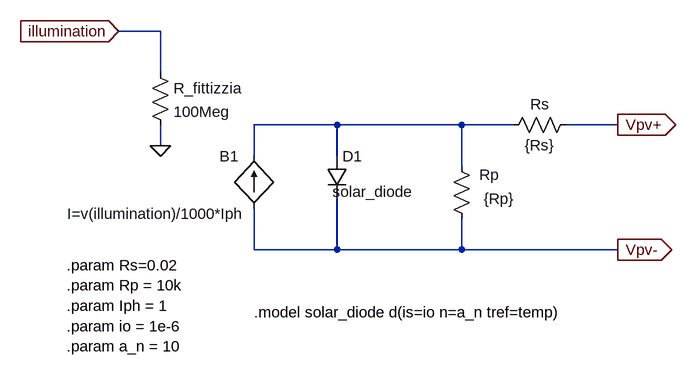
[diagram p0: schematic CellaFotovoltaica.asc]
CellaFotovoltaica.asc, the LTspice schematic file:
Version 4
SHEET 1 880 680
WIRE -80 -64 -144 -64
WIRE -80 0 -80 -64
WIRE 192 80 64 80
WIRE 384 80 192 80
WIRE 464 80 384 80
WIRE 624 80 544 80
WIRE -80 112 -80 80
WIRE 64 128 64 80
WIRE 192 128 192 80
WIRE 384 144 384 80
WIRE 64 272 64 208
WIRE 192 272 192 192
WIRE 192 272 64 272
WIRE 384 272 384 224
WIRE 384 272 192 272
WIRE 624 272 384 272
FLAG -80 112 0
FLAG 624 80 Vpv+
IOPIN 624 80 Out
FLAG 624 272 Vpv-
IOPIN 624 272 Out
FLAG -144 -64 illumination
IOPIN -144 -64 In
SYMBOL bi 64 208 R180
WINDOW 0 24 80 Left 2
WINDOW 3 14 -9 Left 2
SYMATTR InstName B1
SYMATTR Value I=v(illumination)/1000*Iph
SYMBOL diode 176 128 R0
WINDOW 3 9 55 Left 2
SYMATTR Value solar_diode
SYMATTR InstName D1
SYMBOL res 560 64 R90
WINDOW 0 0 56 VBottom 2
WINDOW 3 32 56 VTop 2
SYMATTR InstName Rs
SYMATTR Value {Rs}
SYMBOL res 400 240 R180
WINDOW 0 -42 83 Left 2
WINDOW 3 -65 46 Left 2
SYMATTR InstName Rp
SYMATTR Value {Rp}
SYMBOL res -96 -16 R0
SYMATTR InstName R_fittizzia
SYMATTR Value 100Meg
TEXT 64 368 Left 2 !.model solar_diode d(is=io n=a_n tref=temp)
TEXT -224 296 Left 2 !.param Rs=0.02\n.param Rp = 10k\n.param Iph = 1\n.param io = 1e-6\n.param a_n = 10

The netlist it stands for:
* CellaFotovoltaica.asc
B1 Vpv- N001 I=v(illumination)/1000*Iph
D1 N001 Vpv- solar_diode
Rs Vpv+ N001 {Rs}
Rp Vpv- N001 {Rp}
R_fittizzia illumination 0 100Meg
.model D D
.lib standard.dio
.model solar_diode d(is=io n=a_n tref=temp)
.param Rs=0.02
.param Rp = 10k
.param Iph = 1
.param io = 1e-6
.param a_n = 10
.backanno
.end